# Altium schematic sheet gydrodrive_linearPosSensor.SchDoc
size 297 x 209 mm; SheetNumber: 20; SheetTotal: 22
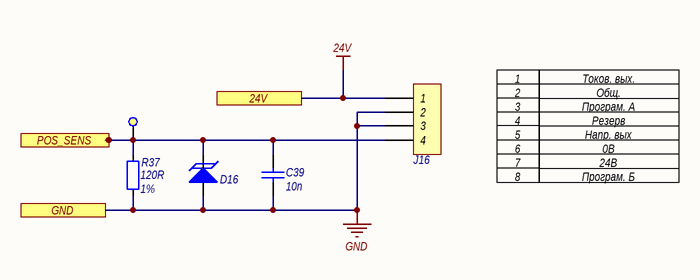
[diagram p0: gydrodrive_linearPosSensor.SchDoc]

## Parts
C39  Capacitance: 10n  [CAPC2012-0805M]  (hidden comment: CAP_0805)
D16  SMBJ3V3-E3/52  [SMB_M]  (value not drawn)
J16  DG142V-5.08-04P  [DG142V-5.08-04P]  (value not drawn)
R37  Resistance: 120R  Tolerance: 1%  [RESC2012-0805M]  (hidden comment: RES_0805)
TP18  Test point 1  [TP_1]  (value not drawn)  (no BOM)

## Ports
24V (see gydrodrive_sensors[3B], gydrodrive_button[2B], gydrodrive_control[2B], gydrodrive_currentSource[2B], gydrodrive_discreteControl[4B], gydrodrive_encoder[3B], gydrodrive_sensor[2B], gydrodrive_sensors[2B], gydrodrive_sto[3B], gydrodrive_supply[2C]), GND (see gydrodrive_sensors[3B], gydrodrive_button[2C], gydrodrive_can[3C], gydrodrive_control[2C], gydrodrive_currentSource[2B], gydrodrive_debugger[3C], gydrodrive_discreteControl[3B], gydrodrive_encoder[1B], gydrodrive_i2c[5C], gydrodrive_indication[3C], gydrodrive_inputTrim[2C], gydrodrive_interfaces[3A], gydrodrive_mcu[6D], gydrodrive_reservedPins[2C], gydrodrive_rs485[3B], gydrodrive_sensor[2C], gydrodrive_sensors[2B], gydrodrive_sto[2C], gydrodrive_supply[2C], gydrodrive_uart[4C]), POS_SENS (out, see gydrodrive_sensors[3B])

## Nets
24V: J16.1 ; port 24V
GND: C39.1 D16.2(A) J16.2 J16.3 R37.1 ; port GND
POS_SENS: C39.2 D16.1(K) J16.4 R37.2 TP18.1 ; port POS_SENS

## Notes on the sheet
- 1
- 2
- 3
- Токов. вых.
- Програм. А
- Общ.
- 4
- 5
- 6
- 7
- 8
- Програм. Б
- Напр. вых
- Резерв
- 0В
- 24В
- Подп. и дата
- Инв. № дубл.
- Взам. инв. №
- Инв. № подл.
- Изм.
- Лист
- № докум.
- Подп.
- Дата
- Копировал
- Формат
- A4

## Library data of the parts
C39 = CAPC_0805: Конденсатор керамический, корпус 0805; Parameters: 10n,  50V; Voltage: 50V; Max Price: 5; Part Number: CAPC_0805; Part Name: ='Конд-р керам. 0805,  '  + Parameters; Component Type: Standart; Pin Count: 2
D16 = SMBJ3V3-E3/52: Защитный диод (TVS); Part Name: Защитный диод SMBJ3V3-E3/52; Parameters: 3V3, 600W; Voltage: 3V3; Max Price: 40; Part Number: SMBJ3V3-E3/52; Component Type: Standart; Pin Count: 0
J16 = DG142V-5.08-04P: Клеммник 4-контактный, шаг 5.08 мм; Part Name: Клеммник DG142V-5.08-04P; Parameters: 8А; Max Price: 60; System: Connector; Part Number: DG142V-5.08-04P; Component Type: Standart; Pin Count: 4
R37 = RESC_0805: Рез-р, корпус 0805; Parameters: 120R, 1%; Max Price: 3; Part Number: RESC_0805; Part Name: ='Рез-р 0805, ' + Parameters; Component Type: Standart
TP18 = Test point 1: Тестовый контакт круглый 1 мм; Part Number: Test point 1; Part Name: Тестовый контакт; Component Type: Standart (No BOM)